# EAGLE schematic DIY_tool_-_Arduino_nano_shield_v1 (EAGLE 8.0.0)
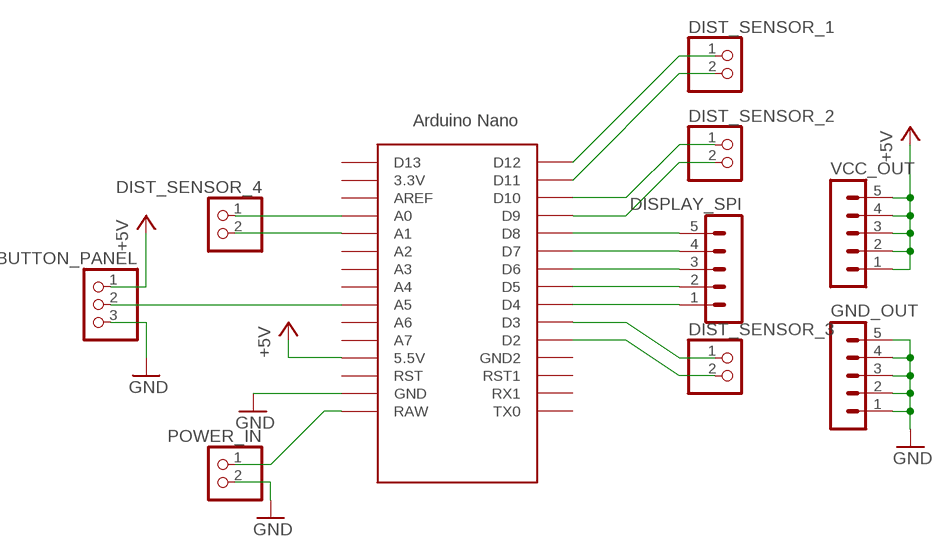
[diagram p0: schematic, sheet 1]

## Parts
BUTTON_PANEL  PINHD-1X3  [1X03]
DISPLAY_SPI  MA05-1  [MA05-1]
DIST_SENSOR_1  PINHD-1X2  [1X02]
DIST_SENSOR_2  PINHD-1X2  [1X02]
DIST_SENSOR_3  PINHD-1X2  [1X02]
DIST_SENSOR_4  PINHD-1X2  [1X02]
GND_OUT  MA05-1  [MA05-1]
POWER_IN  PINHD-1X2  [1X02]
U$1  NANO  [NANO]
VCC_OUT  MA05-1  [MA05-1]

## Nets
+5V: BUTTON_PANEL.1 U$1.5V(5.5V) VCC_OUT.1 VCC_OUT.2 VCC_OUT.3 VCC_OUT.4 VCC_OUT.5
BTN_IN: BUTTON_PANEL.2 U$1.A5
GND: BUTTON_PANEL.3 GND_OUT.1 GND_OUT.2 GND_OUT.3 GND_OUT.4 GND_OUT.5 POWER_IN.2 U$1.GND
OLED_CS: DISPLAY_SPI.1 U$1.D4
OLED_D0: DISPLAY_SPI.5 U$1.D8
OLED_D1: DISPLAY_SPI.4 U$1.D7
OLED_DC: DISPLAY_SPI.2 U$1.D5
OLED_RST: DISPLAY_SPI.3 U$1.D6
POWER_IN: POWER_IN.1 U$1.RAW
SENSOR_1_A: DIST_SENSOR_1.1 U$1.D12
SENSOR_1_B: DIST_SENSOR_1.2 U$1.D11
SENSOR_2_A: DIST_SENSOR_2.1 U$1.D10
SENSOR_2_B: DIST_SENSOR_2.2 U$1.D9
SENSOR_3_A: DIST_SENSOR_3.1 U$1.D3
SENSOR_3_B: DIST_SENSOR_3.2 U$1.D2
SENSOR_4_A: DIST_SENSOR_4.1 U$1.A0
SENSOR_4_B: DIST_SENSOR_4.2 U$1.A1
Unconnected: U$1.3.3V U$1.A2 U$1.A3 U$1.A4 U$1.A6 U$1.A7 U$1.AREF U$1.D13 U$1.GND1(GND2) U$1.ICSP1 U$1.ICSP2 U$1.ICSP3 U$1.ICSP4 U$1.ICSP5 U$1.ICSP6 U$1.RST U$1.RST1 U$1.RX1 U$1.TX0

## Library data of the parts
BUTTON_PANEL = pinhead:PINHD-1X3: PIN HEADER
DISPLAY_SPI GND_OUT VCC_OUT = con-lstb:MA05-1: PIN HEADER; OC_FARNELL: unknown; OC_NEWARK: unknown
DIST_SENSOR_1-DIST_SENSOR_4 POWER_IN = pinhead:PINHD-1X2: PIN HEADER
U$1 = Arduino-clone:NANO: Arduino Nano